# Altium schematic sheet Power.SchDoc
size Tabloid; Organization: Altium Limited; Address1: L3, 12a Rodborough Rd; Address2: Frenchs Forest; Address3: NSW; Address4: Australia 2086
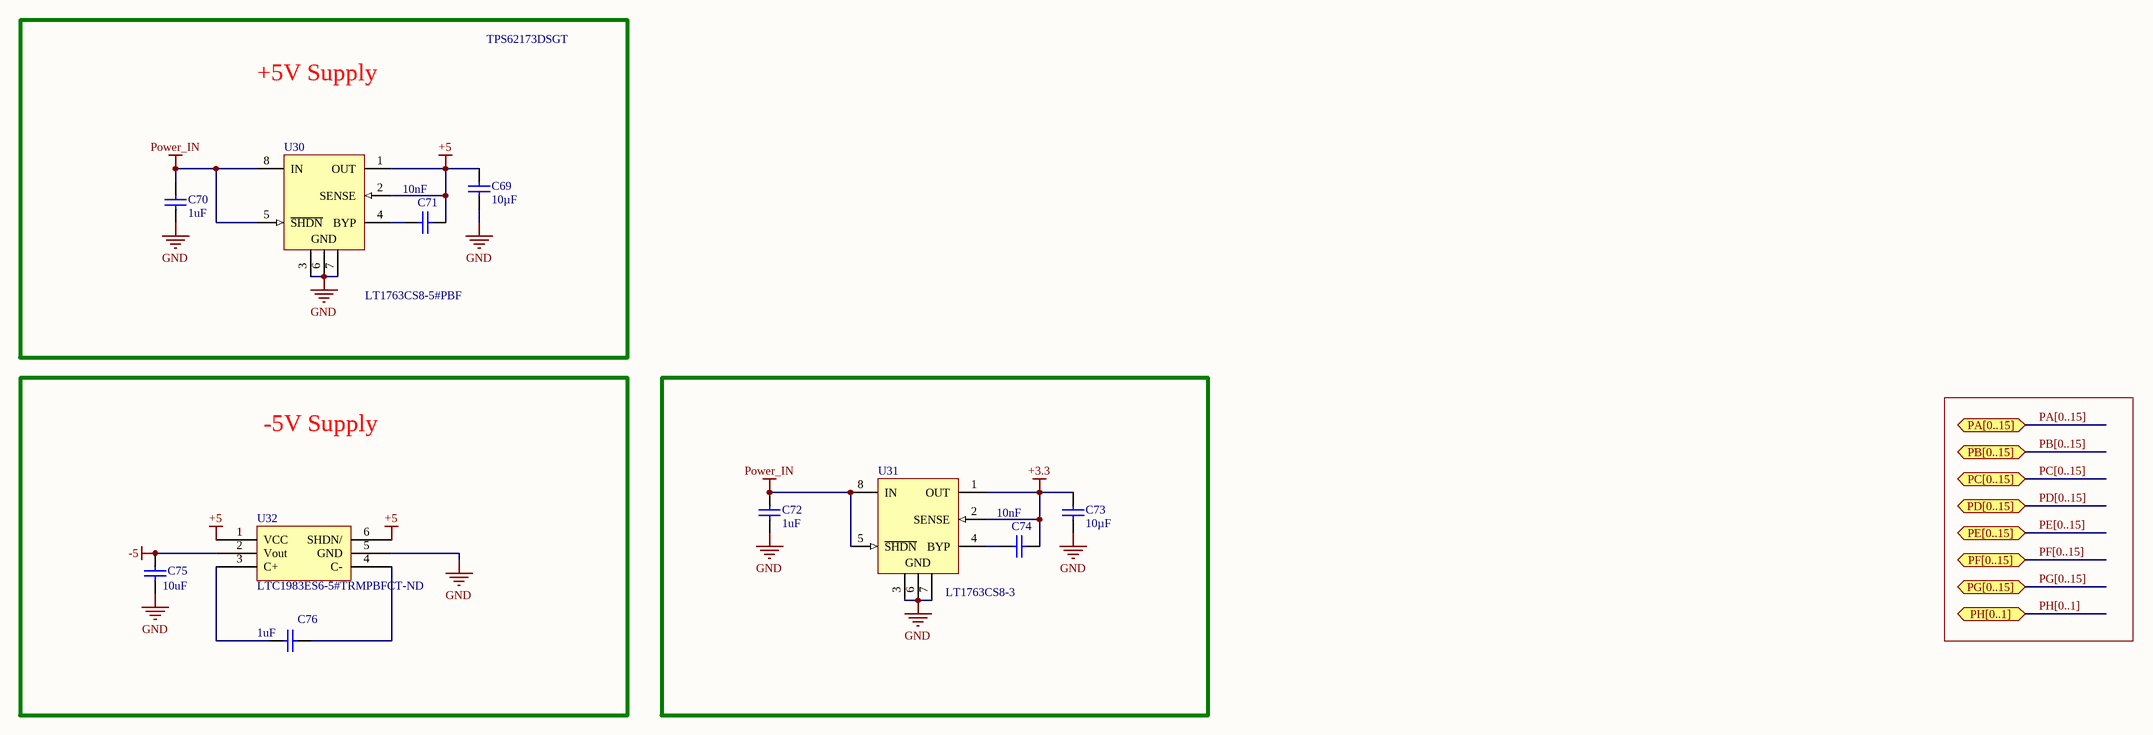
[diagram p0: Power.SchDoc]

## Parts
C69  Capacity (elec.): 10µF  [CAPC3216X180X55LL20T25]  (hidden comment: GRM31CR71C106KA12L)
C70  Capacitance: 1uF  [CAPC3216X110X50LL20T25]  (hidden comment: C1206C105K5RACTU)
C71  value 10nF  [CAPC1206(3216)110_L]  (hidden comment: CAP 10nF 16V 1206(3216))
C72  Capacitance: 1uF  [CAPC3216X110X50LL20T25]  (hidden comment: C1206C105K5RACTU)
C73  Capacity (elec.): 10µF  [CAPC3216X180X55LL20T25]  (hidden comment: GRM31CR71C106KA12L)
C74  value 10nF  [CAPC1206(3216)110_L]  (hidden comment: CAP 10nF 16V 1206(3216))
C75  Capacitance: 10uF  [CAPC1206(3216)130_N]  (hidden comment: JMK316BJ106ML-T)
C76  Capacitance: 1uF  [CAPC3216X110X50LL20T25]  (hidden comment: C1206C105K5RACTU)
U30  LT1763CS8-5#PBF  [LT-S8-8_M]
U31  LT1763CS8-3  [LT-S8-8_L]
U32  Supplier Part Number 1: LTC1983ES6-5#TRMPBFCT-ND  [SOT95P323X100-6N]  (hidden comment: LTC1983ES6-5#TRMPBF)

## Blocks framed on the sheet
+5V Supply: C69-C71 U30
-5V Supply: C75 C76 U32

## Ports
PA[0..15] (bidir), PB[0..15] (bidir), PC[0..15] (bidir), PD[0..15] (bidir), PE[0..15] (bidir), PF[0..15] (bidir), PG[0..15] (bidir), PH[0..1] (bidir)

## Nets
+3.3: C73.2 C74.2 U31.1(OUT) U31.2(SENSE)
+5: C69.2 C71.2 U30.1(OUT) U30.2(SENSE) U32.1(VCC) U32.6(SHDN/)
-5: C75.2 U32.2(Vout)
GND: C69.1 C70.1 C72.1 C73.1 C75.1 U30.3(GND) U30.6(GND) U30.7(GND) U31.3(GND) U31.6(GND) U31.7(GND) U32.5(GND)
Power_IN: C70.2 C72.2 U30.5(~{SHDN}) U30.8(IN) U31.5(~{SHDN}) U31.8(IN)
NetC71_1: C71.1 U30.4(BYP)
NetC74_1: C74.1 U31.4(BYP)
NetC76_1: C76.1 U32.3(C+)
NetC76_2: C76.2 U32.4(C-)

## Buses and harness runs
bus PA[0..15] = port PA[0..15]
bus PB[0..15] = port PB[0..15]
bus PC[0..15] = port PC[0..15]
bus PD[0..15] = port PD[0..15]
bus PE[0..15] = port PE[0..15]
bus PF[0..15] = port PF[0..15]
bus PG[0..15] = port PG[0..15]
bus PH[0..1] = port PH[0..1]

## Notes on the sheet
- TPS62173DSGT
- Title
- Size:
- Date:
- Tabloid
- Number:
- Time:
- Revision:
- Sheet
- of
- File:

## Library data of the parts
C69 C73 = CMP-2000-06351-1: Chip Capacitor, 10 uF, +/- 10%, 16 V, -55 to 125 degC, 1206 (3216 Metric), RoHS, Tape and Reel; Manufacturer: Murata; Type: SMD; Content: 1pc(s); Nominal voltage: 16V; Material properties: X7R; Material: Ceramic; Package Description: 2-Pin Surface Mount Device, Body 3.2 x 1.6 mm; Mounting Technology: SurfaceMount; Tolerance: 10%; Datasheet URL: http://psearch.en.murata.com/capacitor/product/GRM31CR71C106KA12%23.pdf; Package Reference: 1206; Manufacturer URL: http://www.murata.com/; Category: Ceramiccapacitor; Datasheet Version: 10/2016
C70 C72 C76 = CMP-2000-06011-1: Chip Capacitor, 1 uF, +/- 10%, 50 V, -55 to 125 degC, 1206 (3216 Metric), RoHS, Tape and Reel; Manufacturer: Kemet; Case Height: 1mm; Dielectric: X7R; Voltage Rating: 50V; Temperature Coefficient / Code: +/-15%; Case Length: 3.2mm; Case Width: 1.6mm; Type: SMDMLCCX7R6.3-250VDCCommericalGrade; Class: Class1; Capacitance - nF: 1000nF; Datasheet URL: http://www.kemet.com/docfinder?Partnumber=C1206C105K5RACTU; Product Category: MultilayerCeramicCapacitorsMLCC-SMD/SMT; Termination Style: SMD/SMT; Dimensions: 1.6mmWx3.2mmLx1mmH; Voltage Rating DC: 50V; Datasheet Version: 02/2016; Packaging: Reel; Brand: Kemet; RoHS: Details; Minimum Operating Temperature: -55C; Operating Temperature Range: -55Cto+125C; Package Reference: 1206; Manufacturer URL: http://www.kemet.com/; Product: GeneralTypeMLCCs; Tolerance: 10%; Package Description: 2-Pin Surface Mount Device, Body 3.2 x 1.6 mm; Mounting Technology: SurfaceMount; Case Code - mm: 3216; Maximum Operating Temperature: +125C; Series: C1206C; Factory Pack Quantity: 2500; Package / Case: 1206(3216metric); Case Code - in: 1206
C71 C74 = CMP-1037-03470-1: CAP 10nF 16V ±10% 1206 (3216 Metric) Thickness 1.1mm SMD; Case-Metric: 3216; Tolerance: Â±10%; Case-EIA: 1206; Technology: SMT; Max Thickness: 1.1 mm; Rated Voltage: 16 V
C75 = CMP-1037-04913-1: 10µF ±20% 6.3V Ceramic Capacitor X5R 1206 (3216 Metric); Manufacturer: Taiyo Yuden; Notification: Current market demand for these product types have resulted in fluctuating and extending lead times. Lead times may differ.; Supplier 1: Digi-Key; Supplier Part Number 1: 587-5447-1-ND; Manufacturer Part Number: JMK316BJ106ML-T; RoHS: RoHS Compliant; Category: Capacitors; Stock 1: 5600; Pricing 1: 1=0.24, 10=0.161, 100=0.0817, 500=0.05592, 1000=0.04946 (USD); Packaging: Cut Tape (CT); Part Status: Active; Tolerance: ±20%; Voltage - Rated: 6.3V; Temperature Coefficient: X5R; Operating Temperature: -55°C ~ 85°C; Features: -; Ratings: -; Applications: SMPS Filtering; Failure Rate: -; Mounting Type: Surface Mount, MLCC; Package / Case: 1206 (3216 Metric); Size / Dimension: 0.126" L x 0.063" W (3.20mm x 1.60mm); Height - Seated (Max): -; Thickness (Max): 0.071" (1.80mm); Lead Spacing: -; Lead Style: -; ComponentLink1URL: http://ds.yuden.co.jp/TYCOMPAS/ut/detail.do?productNo=JMK316BJ106ML-T&fileName=JMK316BJ106ML-T_SS&mode=specSheetDownload; ComponentLink1Description: http://ds.yuden.co.jp/TYCOMPAS/ut/detail.do?productNo=JMK316BJ106ML-T&fileName=JMK316BJ106ML-T_SS&mode=specSheetDownload
U30 = CMP-0476-01685-1: 500 mA, Low Noise, LDO Micropower Regulator, 1.8 to 20 V Vin, 5 V Vout, 8-pin SOIC (S8-8), -40 to 125 degC, Pb-Free; Manufacturer: Linear Technology; Output Voltage: 5 V; Vin Min(V): 1.8; Discrete Pass Element: no; Number of Outputs: 1; Dropout Voltage(V): 0.3; Vin Max(V): 20; PSRR(dB): 65; Iout(mA): 500; Isupply(mA): 0.03; Mounting Technology: Surface Mount; ComponentLink3Description: Package Specification; PartNumber: LT1763CS8-5#PBF; PackageDescription: 8-Pin Plastic Small Outline (Narrow .150 Inch), Body 4.9 x 3.9 mm, Pitch 1.27 mm; DatasheetVersion: Rev. G; ComponentLink2URL: http://cds.linear.com/docs/en/datasheet/1763fg.pdf; PackageReference: S8-8; ComponentLink1URL: http://www.linear.com/; ComponentLink2Description: Datasheet; ComponentLink1Description: Manufacturer URL; PackageVersion: Rev. G, 03/2012; Shutdown Current(uA): 1; ComponentLink3URL: http://cds.linear.com/docs/en/packaging/05081610_G_SO8.pdf; RoHS: TRUE; Noise(uV): 20
U31 = CMP-0476-01667-1: 500 mA, Low Noise, LDO Micropower Regulator, 1.8 to 20 V Vin, 3 V Vout, 8-pin SOIC (S8-8), -40 to 125 degC; Manufacturer: Linear Technology; Shutdown Current(uA): 1; Discrete Pass Element: no; Iout(mA): 500; PSRR(dB): 65; Vin Min(V): 1.8; Output Voltage: 3 V; Vin Max(V): 20; Dropout Voltage(V): 0.3; Isupply(mA): 0.03; PartNumber: LT1763CS8-3; ComponentLink1URL: http://www.linear.com/; PackageDescription: 8-Pin Plastic Small Outline (Narrow .150 Inch), Body 4.9 x 3.9 mm, Pitch 1.27 mm; Mounting Technology: Surface Mount; ComponentLink2Description: Datasheet; Noise(uV): 20; ComponentLink1Description: Manufacturer URL; ComponentLink3Description: Package Specification; RoHS: FALSE; PackageVersion: Rev. G, 03/2012; DatasheetVersion: Rev. G; ComponentLink2URL: http://cds.linear.com/docs/en/datasheet/1763fg.pdf; ComponentLink3URL: http://cds.linear.com/docs/en/packaging/05081610_G_SO8.pdf; Number of Outputs: 1; PackageReference: S8-8
U32 = LTC1983ES6-5#TRMPBF: Charge Pump Switching Regulator IC Negative Fixed -5V 1 Output 100mA SOT-23-6 Thin, TSOT-23-6; Manufacturer: Linear Technology/Analog Devices; Function: Step-Down; Number of Outputs: 1; Voltage - Input (Min): 2.3V; Voltage - Input (Max): 5.5V; Frequency - Switching: 900kHz; Synchronous Rectifier: No; Supplier 1: Digi-Key; Manufacturer Part Number: LTC1983ES6-5#TRMPBF; RoHS: RoHS Compliant; Category: Integrated Circuits (ICs); Stock 1: 17516; Pricing 1: 1=4.36, 25=3.8952, 100=2.3256, 250=2.1318 (USD); Packaging: Cut Tape (CT); Part Status: Active; Output Configuration: Negative; Topology: Charge Pump; Output Type: Fixed; Voltage - Output (Min/Fixed): -5V; Voltage - Output (Max): -; Current - Output: 100mA; Operating Temperature: -40°C ~ 85°C (TA); Mounting Type: Surface Mount; Package / Case: SOT-23-6 Thin, TSOT-23-6; Supplier Device Package: TSOT-23-6; Base Part Number: LTC1983-5; ComponentLink1URL: http://www.linear.com/docs/2135; ComponentLink1Description: http://www.linear.com/docs/2135